# EAGLE design sr_controller_v0 (EAGLE 6.3)
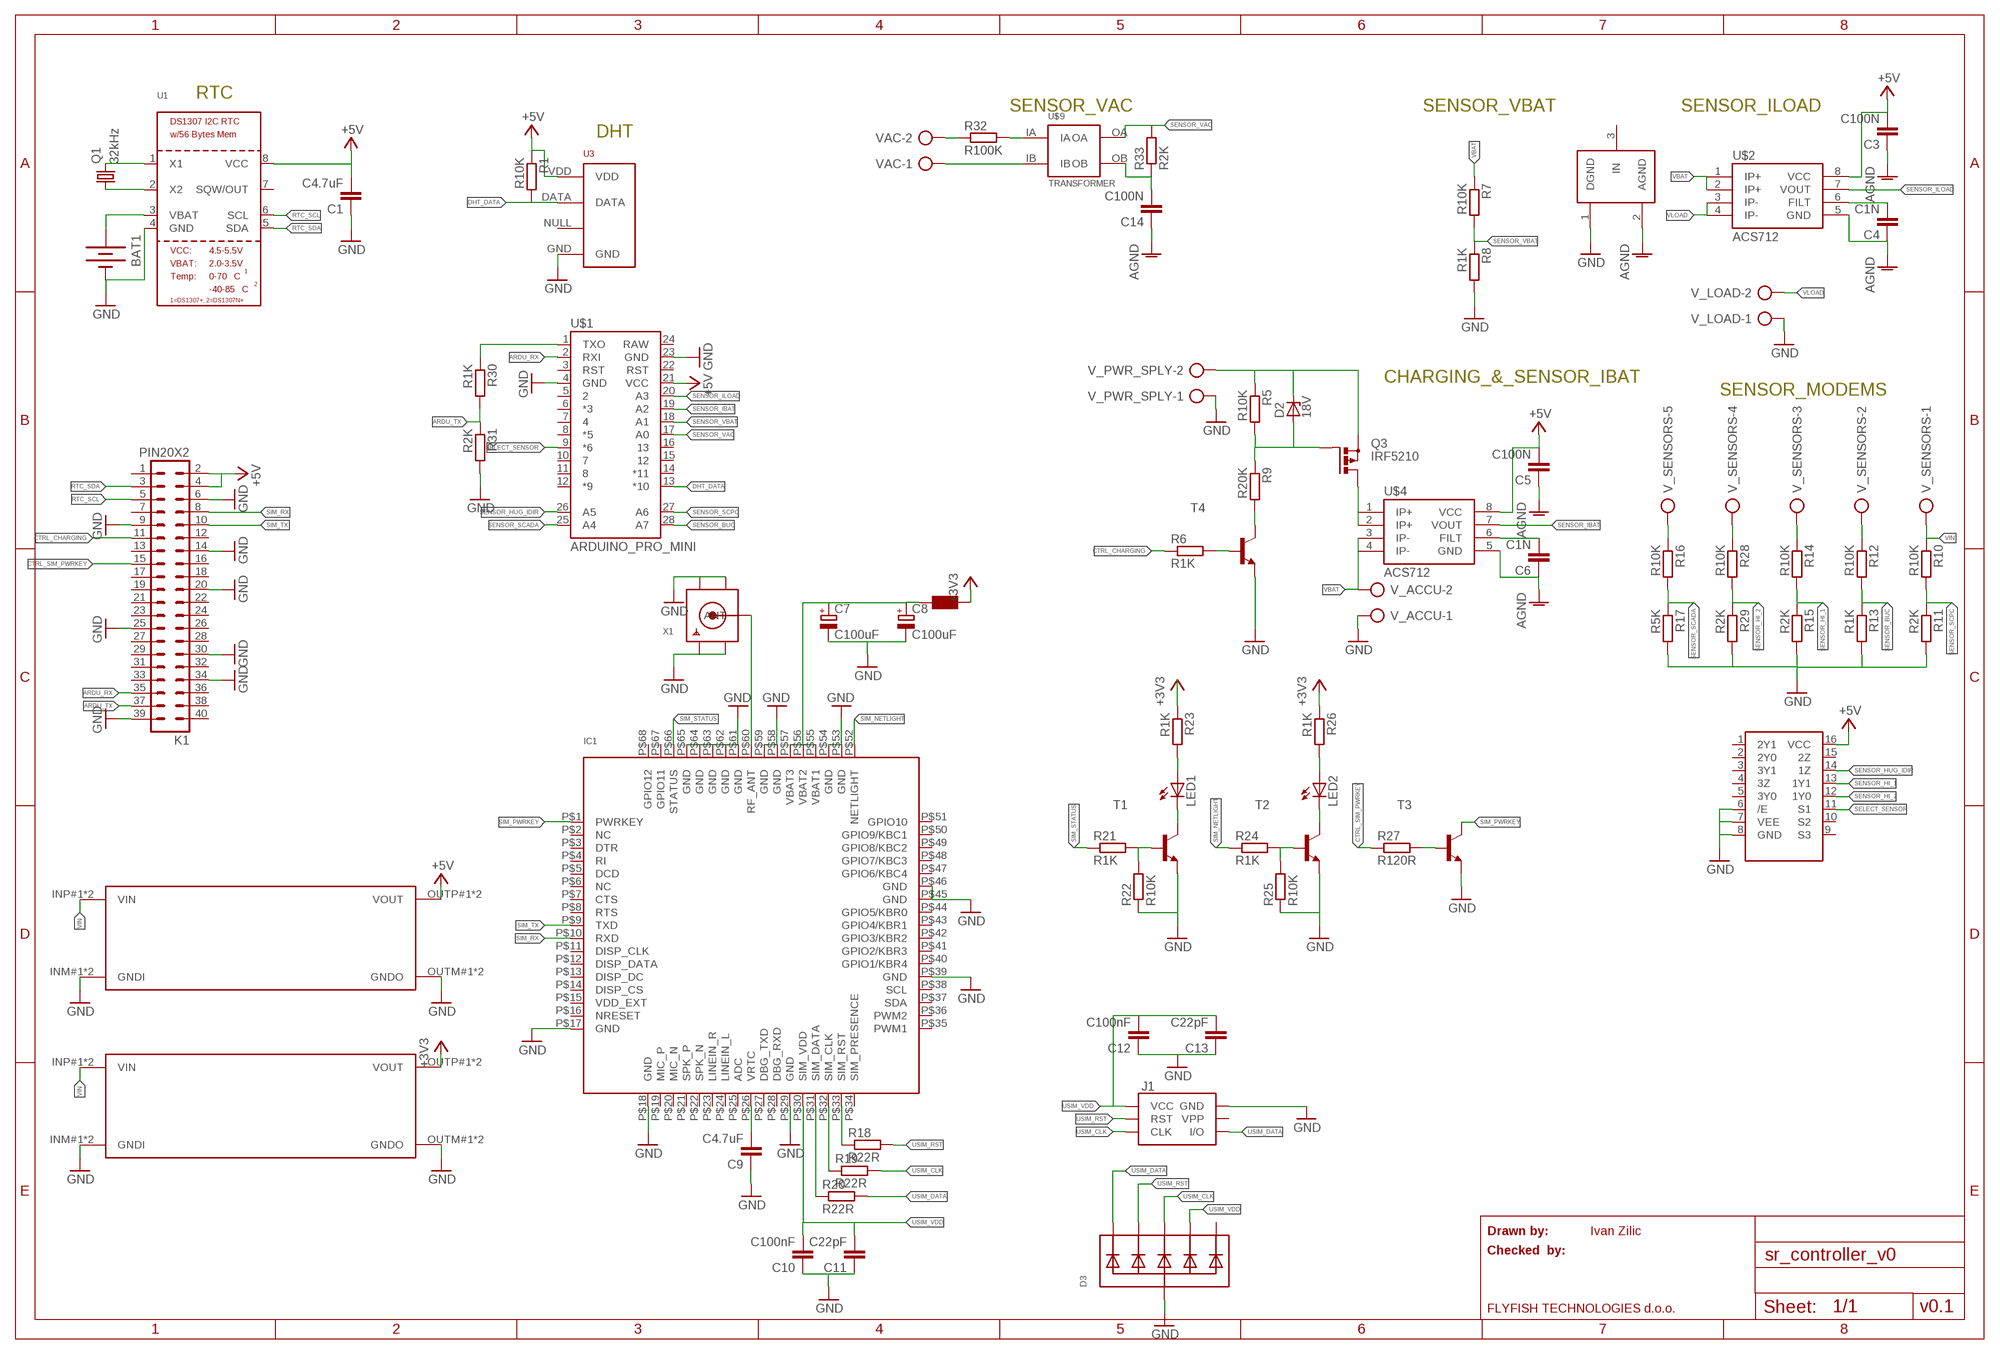
[diagram p0: schematic, sheet 1]

## Parts
BAT1  BATTERY20PTH  [BATTCOM_20MM_PTH]
C1  C4.7uF  C-EUC0805  [C0805]
C3  C100N  C-EUC0805K  [C0805K]
C4  C1N  C-EUC0805K  [C0805K]
C5  C100N  C-EUC0805K  [C0805K]
C6  C1N  C-EUC0805K  [C0805K]
C7  C100uF  CPOL-EU153CLV-0605  [153CLV-0605]
C8  C100uF  CPOL-EU153CLV-0605  [153CLV-0605]
C9  C4.7uF  C-EUC0805  [C0805]
C10  C100nF  C-EUC0805  [C0805]
C11  C22pF  C-EUC0805  [C0805]
C12  C100nF  C-EUC0805  [C0805]
C13  C22pF  C-EUC0805  [C0805]
C14  C100N  C-EUC0805K  [C0805K]
D2  18V  ZENER-DIODEDO41Z10  [DO41Z10]
D3  TVSARRAY_5LANE  [SOT363]
IC1  GSM_SIM900_LITERAL  [SIM900_SMT]
J1  SIMHOLDERSIM  [SIMHOLDER]
K1  PIN20X2  [PIN_20X2]
LED1  LEDCHIPLED_0805  [CHIPLED_0805]
LED2  LEDCHIPLED_0805  [CHIPLED_0805]
Q1  32kHz  CRYSTALTC38H  [TC38H]
Q3  IRF5210  PMOSFET_PTO220BV  [TO220BV]
R1  R10K  R-EU_R0805  [R0805]
R5  R10K  R-EU_R0805  [R0805]
R6  R1K  R-EU_R0805  [R0805]
R7  R10K  R-EU_R0805  [R0805]
R8  R1K  R-EU_R0805  [R0805]
R9  R20K  R-EU_R0805  [R0805]
R10  R10K  R-EU_R0805  [R0805]
R11  R2K  R-EU_R0805  [R0805]
R12  R10K  R-EU_R0805  [R0805]
R13  R1K  R-EU_R0805  [R0805]
R14  R10K  R-EU_R0805  [R0805]
R15  R2K  R-EU_R0805  [R0805]
R16  R10K  R-EU_R0805  [R0805]
R17  R5K  R-EU_R0805  [R0805]
R18  R22R  R-EU_R0805  [R0805]
R19  R22R  R-EU_R0805  [R0805]
R20  R22R  R-EU_R0805  [R0805]
R21  R1K  R-EU_R0805  [R0805]
R22  R10K  R-EU_R0805  [R0805]
R23  R1K  R-EU_R0805  [R0805]
R24  R1K  R-EU_R0805  [R0805]
R25  R10K  R-EU_R0805  [R0805]
R26  R1K  R-EU_R0805  [R0805]
R27  R120R  R-EU_R0805  [R0805]
R28  R10K  R-EU_R0805  [R0805]
R29  R2K  R-EU_R0805  [R0805]
R30  R1K  R-EU_R0805  [R0805]
R31  R2K  R-EU_R0805  [R0805]
R32  R100K  R-EU_0309/V  [0309V]
R33  R2K  R-EU_0309/V  [0309V]
T1  MMBT2222ALT1-NPN-SOT23-BEC  [SOT23-BEC]
T2  MMBT2222ALT1-NPN-SOT23-BEC  [SOT23-BEC]
T3  MMBT2222ALT1-NPN-SOT23-BEC  [SOT23-BEC]
T4  MMBT2222ALT1-NPN-SOT23-BEC  [SOT23-BEC]
U1  RTC_DS1307  [SOIC8_150MIL]
U3  RHT03_DHT-22_AM2302  [RHT03_DHT-22]
U$1  ARDUINO_PRO_MINI  [ARDUINO_PRO_MINI]
U$2  ACS712  [SO08]
U$3  GND_CONNECT  [GND_CONNECT]
U$4  ACS712  [SO08]
U$5  FB0603  L0603  [L0603]
U$6  DCDCMODULE_SMALL  [DCDCMODULE-SMALL]
U$7  DCDCMODULE_SMALL  [DCDCMODULE-SMALL]
U$8  74HC4053D  [SO16]
U$9  TRANSFORMER  [TV16]
V_ACCU  AK300/2  [AK300/2]
V_LOAD  AK300/2  [AK300/2]
V_PWR_SPLY  AK300/2  [AK300/2]
V_SENSORS  AK300/5  [AK300/5]
VAC  AK300/2  [AK300/2]
X1  SMACONNECTOR  [SMA90_DIP]

## Nets
+3V3: R23.1 R26.1 U$5.2 U$7.OUTP#1(VOUT) U$7.OUTP#2(VOUT)
+5V: C1.2 C3.2 C5.2 K1.2 K1.4 R1.1 U1.8(VCC) U3.VDD U$1.21(VCC) U$2.8(VCC) U$4.8(VCC) U$6.OUTP#1(VOUT) U$6.OUTP#2(VOUT) U$8.16(VCC)
AGND: C3.1 C4.1 C5.1 C6.1 C14.1 U$2.5(GND) U$3.2(AGND) U$4.5(GND)
ARDU_RX: K1.35 U$1.2(RXI)
ARDU_TX: K1.37 R30.2 R31.1
CTRL_CHARGING: K1.11 R6.1
CTRL_SIM_PWRKEY: K1.15 R27.1
DHT_DATA: R1.2 U3.DATA U$1.13(*10)
GND: BAT1.2(-) C1.1 C7.- C8.- C9.1 C10.1 C11.1 C12.1 C13.1 D3.2(A) IC1.P$17(GND) IC1.P$18(GND) IC1.P$29(GND) IC1.P$39(GND) IC1.P$45(GND) IC1.P$46(GND) IC1.P$53(GND) IC1.P$54(GND) IC1.P$58(GND) IC1.P$59(GND) IC1.P$61(GND) IC1.P$62(GND) IC1.P$63(GND) IC1.P$64(GND) IC1.P$65(GND) J1.C5(GND) K1.6 K1.9 K1.14 K1.20 K1.25 K1.30 K1.34 K1.39 R8.2 R11.2 R13.2 R15.2 R17.2 R22.1 R25.1 R29.2 R31.2 T1.E T2.E T3.E T4.E U1.4(GND) U3.GND U$1.4(GND) U$1.23(GND) U$3.1(DGND) U$6.INM#1(GNDI) U$6.INM#2(GNDI) U$6.OUTM#1(GNDO) U$6.OUTM#2(GNDO) U$7.INM#1(GNDI) U$7.INM#2(GNDI) U$7.OUTM#1(GNDO) U$7.OUTM#2(GNDO) U$8.6(/E) U$8.7(VEE) U$8.8(GND) V_ACCU.1 V_LOAD.1 V_PWR_SPLY.1 X1.GND1 X1.GND2 X1.GND3 X1.GND4
N$1: R32.1 VAC.2
N$2: U$9.IB VAC.1
N$3: Q1.2 U1.1(X1)
N$4: Q1.1 U1.2(X2)
N$5: BAT1.1(+) U1.3(VBAT)
N$6: R12.1 V_SENSORS.2
N$10: C4.2 U$2.6(FILT)
N$11: D2.A Q3.G R5.2 R9.1
N$12: D2.C Q3.S R5.1 V_PWR_SPLY.2
N$13: R6.2 T4.B
N$14: R9.2 T4.C
N$15: Q3.D U$4.1(IP+) U$4.2(IP+)
N$16: C6.2 U$4.6(FILT)
N$18: R14.1 V_SENSORS.3
N$19: R28.1 V_SENSORS.4
N$20: R16.1 V_SENSORS.5
N$21: IC1.P$60(RF_ANT) X1.ANTENNA(ANT)
N$22: C7.+ C8.+ IC1.P$55(VBAT1) IC1.P$56(VBAT2) IC1.P$57(VBAT3) U$5.1
N$23: C9.2 IC1.P$26(VRTC)
N$24: IC1.P$33(SIM_RST) R18.1
N$25: IC1.P$32(SIM_CLK) R19.1
N$26: IC1.P$31(SIM_DATA) R20.1
N$27: LED1.C T1.C
N$28: LED1.A R23.2
N$29: LED2.C T2.C
N$30: R21.2 R22.2 T1.B
N$31: LED2.A R26.2
N$32: R24.2 R25.2 T2.B
N$33: R27.2 T3.B
N$35: R30.1 U$1.1(TXO)
N$36: R32.2 U$9.IA
N$38: C14.2 R33.1 U$9.OB
RTC_SCL: K1.5 U1.6(SCL)
RTC_SDA: K1.3 U1.5(SDA)
SELECT_SENSOR: U$1.9(*6) U$8.11(S1)
SENSOR_BUC: R12.2 R13.1 U$1.28(A7)
SENSOR_HI_1: R14.2 R15.1 U$8.13(1Y1)
SENSOR_HI_2: R28.2 R29.1 U$8.12(1Y0)
SENSOR_HUG_IDIR: U$1.26(A5) U$8.14(1Z)
SENSOR_IBAT: U$1.19(A2) U$4.7(VOUT)
SENSOR_ILOAD: U$1.20(A3) U$2.7(VOUT)
SENSOR_SCADA: R16.2 R17.1 U$1.25(A4)
SENSOR_SCPC: R10.2 R11.1 U$1.27(A6)
SENSOR_VAC: R33.2 U$1.17(A0) U$9.OA
SENSOR_VBAT: R7.2 R8.1 U$1.18(A1)
SIM_NETLIGHT: IC1.P$52(NETLIGHT) R24.1
SIM_PWRKEY: IC1.P$1(PWRKEY) T3.C
SIM_RX: IC1.P$10(RXD) K1.8
SIM_STATUS: IC1.P$66(STATUS) R21.1
SIM_TX: IC1.P$9(TXD) K1.10
USIM_CLK: D3.4(C3) J1.C3(CLK) R19.2
USIM_DATA: D3.1(C1) J1.C7(I/O) R20.2
USIM_RST: D3.3(C2) J1.C2(RST) R18.2
USIM_VDD: C10.2 C11.2 C12.2 C13.2 D3.5(C4) IC1.P$30(SIM_VDD) J1.C1(VCC)
VBAT: R7.1 U$2.1(IP+) U$2.2(IP+) U$4.3(IP-) U$4.4(IP-) V_ACCU.2
VIN: R10.1 U$6.INP#1(VIN) U$6.INP#2(VIN) U$7.INP#1(VIN) U$7.INP#2(VIN) V_SENSORS.1
VLOAD: U$2.3(IP-) U$2.4(IP-) V_LOAD.2
Unconnected: D3.6(C5) IC1.P$2(NC) IC1.P$3(DTR) IC1.P$4(RI) IC1.P$5(DCD) IC1.P$6(NC) IC1.P$7(CTS) IC1.P$8(RTS) IC1.P$11(DISP_CLK) IC1.P$12(DISP_DATA) IC1.P$13(DISP_DC) IC1.P$14(DISP_CS) IC1.P$15(VDD_EXT) IC1.P$16(NRESET) IC1.P$19(MIC_P) IC1.P$20(MIC_N) IC1.P$21(SPK_P) IC1.P$22(SPK_N) IC1.P$23(LINEIN_R) IC1.P$24(LINEIN_L) IC1.P$25(ADC) IC1.P$27(DBG_TXD) IC1.P$28(DBG_RXD) IC1.P$34(SIM_PRESENCE) IC1.P$35(PWM1) IC1.P$36(PWM2) IC1.P$37(SDA) IC1.P$38(SCL) IC1.P$40(GPIO1/KBR4) IC1.P$41(GPIO2/KBR3) IC1.P$42(GPIO3/KBR2) IC1.P$43(GPIO4/KBR1) IC1.P$44(GPIO5/KBR0) IC1.P$47(GPIO6/KBC4) IC1.P$48(GPIO7/KBC3) IC1.P$49(GPIO8/KBC2) IC1.P$50(GPIO9/KBC1) IC1.P$51(GPIO10) J1.C6(VPP) K1.1 K1.7 K1.12 K1.13 K1.16 K1.17 K1.18 K1.19 K1.21 K1.22 K1.23 K1.24 K1.26 K1.27 K1.28 K1.29 K1.31 K1.32 K1.33 K1.36 K1.38 K1.40 U1.7(SQW/OUT) U3.NULL U$1.3(RST) U$1.5 U$1.6(*3) U$1.7 U$1.8(*5) U$1.10 U$1.11 U$1.12(*9) U$1.14(*11) U$1.15 U$1.16 U$1.22(RST) U$1.24(RAW) U$3.3(IN) U$8.1(2Y1) U$8.2(2Y0) U$8.3(3Y1) U$8.4(3Z) U$8.5(3Y0) U$8.9(S3) U$8.10(S2) U$8.15(2Z)

## Notes on the sheet
- RTC
- SENSOR_VAC | SENSOR_VBAT | SENSOR_ILOAD
- DHT
- CHARGING_&_SENSOR_IBAT
- SENSOR_MODEMS
- Drawn by: | Ivan Zilic
- Checked  by:
- FLYFISH TECHNOLOGIES d.o.o. | v0.1

## Power pins joined to a net without a drawn wire
GPIO11: IC1.P$67(GPIO11)
GPIO12: IC1.P$68(GPIO12)

## Library data of the parts
BAT1 = SparkFun-Electromechanical:BATTERY: Battery Holders Various common sizes : AA, AAA, 20mm coin cell and 12mm coin cell. 20MM_4LEGS, BATT-10373
C1 C3-C6 C9-C14 = resistor:C-EU: CAPACITOR, European symbol
C7 C8 = resistor:CPOL-EU: POLARIZED CAPACITOR, European symbol
D2 = diode:ZENER-DIODE: Z-Diode
D3 = microbuilder:TVSARRAY_5LANE: Voltage Transient Suppressor Array SOT363 SMF05C - 100W 5V: Digikey - SMF05CT1GOSCT-ND
IC1 = microbuilder:GSM_SIM900_LITERAL: SIM900 Quad-Band GSM/GPRS Module Power Supply: 3.2-4.8V Temperature Range: -30�C-+80�C Bands: GSM 850, EGSM 900, DCS 1800, PCS 1900
J1 = SparkFun-Connectors:SIMHOLDER: SIM Socket Socket for SIM cellular cards. Schematic element and footprint production proven. Spark Fun Electronics SKU : PRT-00548; PROD_ID: CONN-08536
K1 = FLYFISH:PIN20X2
LED1 LED2 = adafruit:LED: LED OSRAM: - CHIPLED LG R971, LG N971, LY N971, LG Q971, LY Q971, LO R971, LY R971 LH N974, LH R974 LS Q976, LO Q976, LY Q976 LO Q996 - Hyper CHIPLED LW Q18S LB Q993, LB Q99A, LB R99A - SideLED LS A670, LO A670, LY A670, LG A670, LP A670 LB A673, LV A673, LT A673, LW A673 LH A674 LY A675 LS A676, LA A676, LO A676, LY A676, LW A676 LS A679, LY A679, LG A679 - Hyper Micro SIDELED® LS Y876, LA Y876, LO Y876, LY Y876 LT Y87S - SmartLED LW L88C, LW L88S LB L89C, LB L89S, LG L890 LS L89K, LO L89K, LY L89K LS L896, LA L896, LO L896, LY L896 - TOPLED LS T670, LO T670, LY T670, LG T670, LP T670 LSG T670, LSP T670, LSY T670, LOP T670, LYG T670 LG T671, LOG T671, LSG T671 LB T673, LV T673, LT T673, LW T673 LH T674 LS T676, LA T676, LO T676, LY T676, LB T676, LH T676, LSB T676, LW T676 LB T67C, LV T67C, LT T67C, LS T67K, LO T67K, LY T67K, LW E67C LS E67B, LA E67B, LO E67B, LY E67B, LB E67C, LV E67C, LT E67C LW T67C LS T679, LY T679, LG T679 LS T770, LO T770, LY T770, LG T770, LP T770 LB T773, LV T773, LT T773, LW T773 LH T774 LS E675, LA E675, LY E675, LS T675 LS T776, LA T776, LO T776, LY T776, LB T776 LHGB T686 LT T68C, LB T68C - Hyper Mini TOPLED® LB M676 - Mini TOPLED Santana® LG M470 LS M47K, LO M47K, LY M47K Source: http://www.osram.convergy.de/
Q1 = crystal:CRYSTAL: CRYSTAL; OC_FARNELL: unknown; OC_NEWARK: unknown
Q3 = transistor-power:PMOSFET_P: Power MOSFET P-Channel
R1 R5-R33 = resistor:R-EU_: RESISTOR, European symbol
T1-T4 = transistor:*-NPN-: NPN Transistror BF959 corrected 2008.03.06
U1 = microbuilder:RTC_DS1307: DS1307 I2C RTC with 56-Bytes RAM
U3 = RHT03_DHT-22_AM2302:RHT03_DHT-22_AM2302: RHT03 / DHT-22 / AM2302 Packages and symbol for the RHT03 / DHT-22 relative humidity and temperature sensor. Note: The AM2302 is a wired version of the DHT-22 which typically requires less clearance and is thus provided as a separate package.; PROD_ID: SEN-10167
U$1 = tigorcustom:ARDUINO_PRO_MINI
U$2 U$4 = SparkFun-AnalogIC:ACS712: Hall-effect-based isolated linear current sensor
U$3 = SparkFun-Passives:GND_CONNECT: Use to make a connection of multiple grounds in only one place.
U$5 = tigorcustom:L0603
U$6 U$7 = bontor:DCDCMODULE_SMALL
U$8 = tigorcustom:74HC4053D
U$9 = bontor:TRANSFORMER
V_ACCU V_LOAD V_PWR_SPLY VAC = con-ptr500:AK300/2: CONNECTOR; OC_FARNELL: unknown; OC_NEWARK: unknown
V_SENSORS = con-ptr500:AK300/5: CONNECTOR; OC_FARNELL: unknown; OC_NEWARK: unknown
X1 = microbuilder:SMACONNECTOR: SMA Connector 90� DIP SMA Connector, 50 Ohm (4UConnector: 07259)

## Board
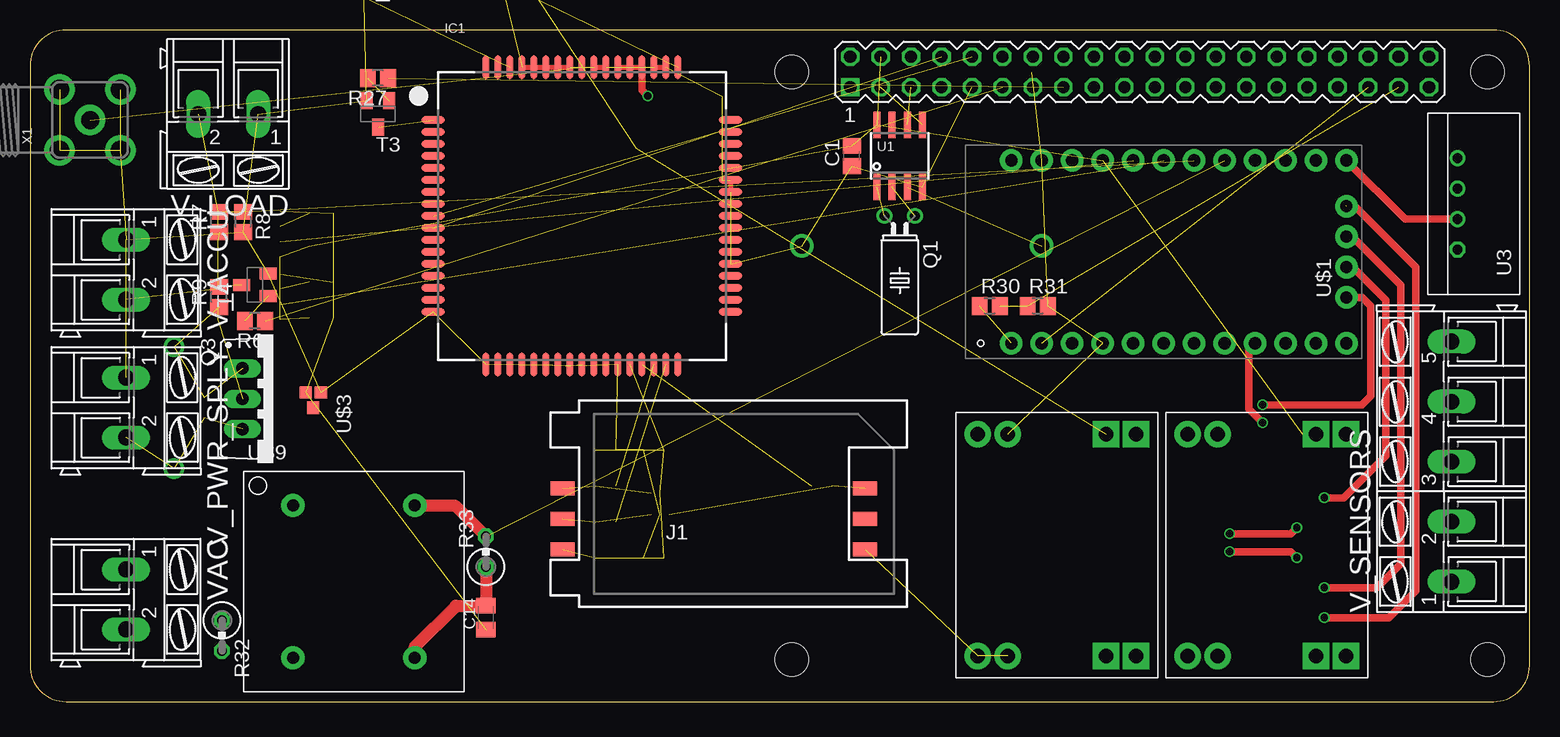
[diagram p1: board, top side]
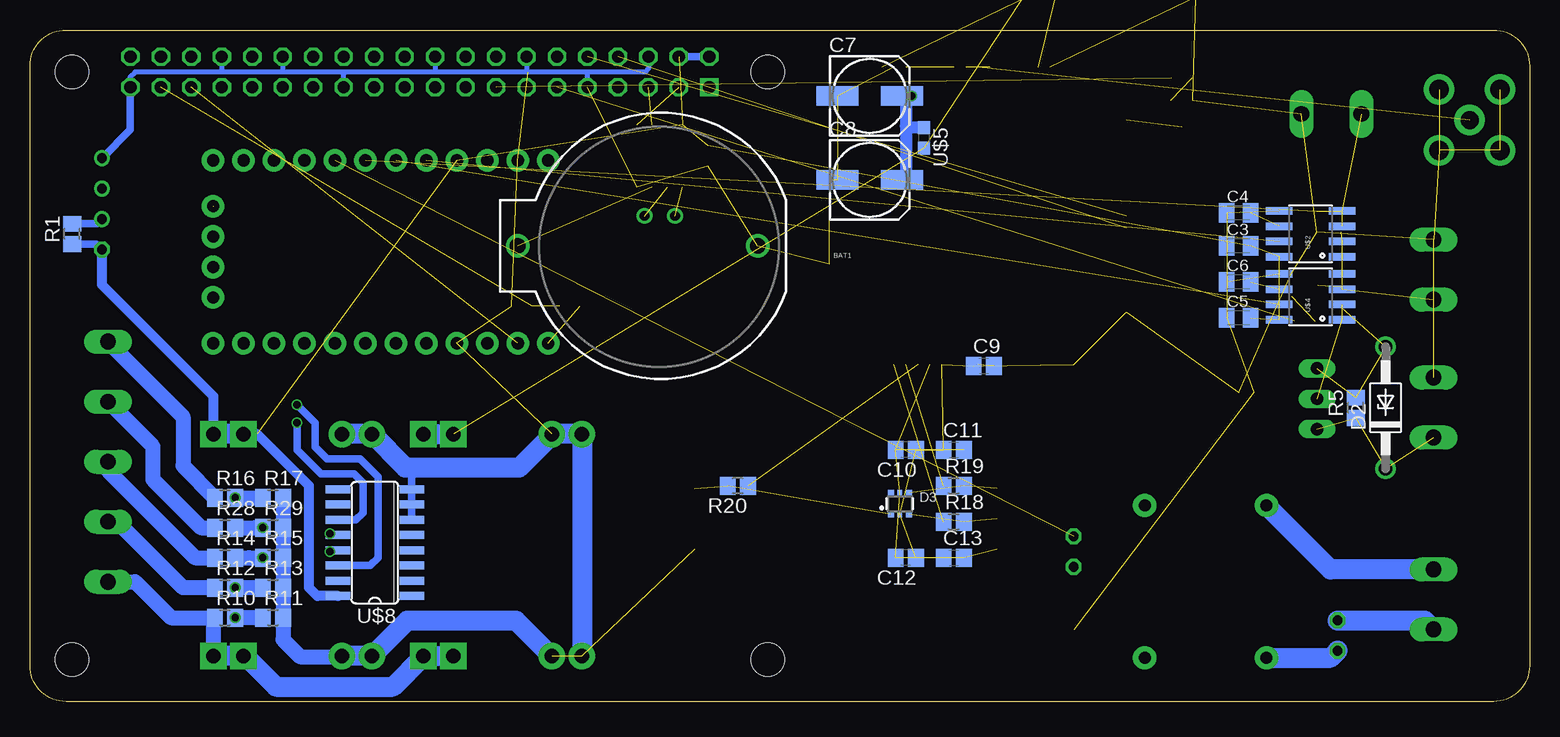
[diagram p2: board, bottom side, seen from below]

Size 125 x 56 mm. Coordinates in mm from the lower left corner, seen from the top.
Outline: 0,3 arc90 3,0 122,0 arc90 125,3 125,53 arc90 122,56 3,56 arc90 0,53 0,3
Copper layers (1*16): Top 0.035mm / dielectric 1.5mm / Bottom 0.035mm
Design rules "ITEADstudio_DRC": minimum track width 6mil, minimum drill 12mil, track to track 6mil, track to pad 6mil, pad to pad 6mil, via to via 6mil, smd to smd 0mil, copper to edge 10mil, drill to drill 10mil, minimum pad ring 10mil, minimum via ring 6mil, stop-mask expansion 2mil, vias tented up to drill 100mil, thermal gap 10mil
Holes 2.8 mm at 63.5,3.5 63.5,52.5 121.5,52.5 121.5,3.5
tRestrict: area 62,51 to 65,54; area 120,51 to 123,54; area 120,1.9 to 123,5; area 62,1.9 to 65,5
bRestrict: area 62,1.9 to 65,5; area 62,51 to 65,54; area 120,1.9 to 123,5; area 120,51 to 123,54

### Footprints (pad centres in the part's own frame; a part is rotated, then mirrored left to right if it is on the bottom)
BATTCOM_20MM_PTH = drill 1.3: 1 11.85,0; 2 -8.15,0
C0805 = smd 1.3 x 1.5: 1 -0.85,0; 2 0.85,0
C0805K = smd 1.3 x 1.6: 1 -1,0; 2 1,0
153CLV-0605 = smd 3.5 x 1.6: + 2.7,0; - -2.7,0
DO41Z10 = drill 1.118: A 5.08,0; C -5.08,0
SOT363 = smd 0.5 x 0.5: 1 -0.75,-0.9; 3 0.75,-0.9; 4 0.75,0.9; 6 -0.75,0.9 | smd 0.4 x 0.5: 2 0,-0.9; 5 0,0.9
SIM900_SMT = smd 2 x 0.6: P$1 -12.4,8; P$2 -12.4,7; P$3 -12.4,6; P$4 -12.4,5; P$5 -12.4,4; P$6 -12.4,3; P$7 -12.4,2; P$8 -12.4,1; P$9 -12.4,0; P$10 -12.4,-1; P$11 -12.4,-2; P$12 -12.4,-3; P$13 -12.4,-4; P$14 -12.4,-5; P$15 -12.4,-6; P$16 -12.4,-7; P$17 -12.4,-8; P$35 12.4,-8; P$36 12.4,-7; P$37 12.4,-6; P$38 12.4,-5; P$39 12.4,-4; P$40 12.4,-3; P$41 12.4,-2; P$42 12.4,-1; P$43 12.4,0; P$44 12.4,1; P$45 12.4,2; P$46 12.4,3; P$47 12.4,4; P$48 12.4,5; P$49 12.4,6; P$50 12.4,7; P$51 12.4,8 | smd 0.6 x 2: P$18 -8,-12.4; P$19 -7,-12.4; P$20 -6,-12.4; P$21 -5,-12.4; P$22 -4,-12.4; P$23 -3,-12.4; P$24 -2,-12.4; P$25 -1,-12.4; P$26 0,-12.4; P$27 1,-12.4; P$28 2,-12.4; P$29 3,-12.4; P$30 4,-12.4; P$31 5,-12.4; P$32 6,-12.4; P$33 7,-12.4; P$34 8,-12.4; P$52 8,12.4; P$53 7,12.4; P$54 6,12.4; P$55 5,12.4; P$56 4,12.4; P$57 3,12.4; P$58 2,12.4; P$59 1,12.4; P$60 0,12.4; P$61 -1,12.4; P$62 -2,12.4; P$63 -3,12.4; P$64 -4,12.4; P$65 -5,12.4; P$66 -6,12.4; P$67 -7,12.4; P$68 -8,12.4
SIMHOLDER = smd 2 x 1.2: C1 -12.61,-3.81; C2 -12.61,-1.27; C3 -12.61,1.27; C5 12.61,-3.81; C6 12.61,-1.27; C7 12.61,1.27
PIN_20X2 = drill 1.016 square: 1 -24.13,-1.27 | drill 1.016 octagon: 2 -24.13,1.27; 3 -21.59,-1.27; 4 -21.59,1.27; 5 -19.05,-1.27; 6 -19.05,1.27; 7 -16.51,-1.27; 8 -16.51,1.27; 9 -13.97,-1.27; 10 -13.97,1.27; 11 -11.43,-1.27; 12 -11.43,1.27; 13 -8.89,-1.27; 14 -8.89,1.27; 15 -6.35,-1.27; 16 -6.35,1.27; 17 -3.81,-1.27; 18 -3.81,1.27; 19 -1.27,-1.27; 20 -1.27,1.27; 21 1.27,-1.27; 22 1.27,1.27; 23 3.81,-1.27; 24 3.81,1.27; 25 6.35,-1.27; 26 6.35,1.27; 27 8.89,-1.27; 28 8.89,1.27; 29 11.43,-1.27; 30 11.43,1.27; 31 13.97,-1.27; 32 13.97,1.27; 33 16.51,-1.27; 34 16.51,1.27; 35 19.05,-1.27; 36 19.05,1.27; 37 21.59,-1.27; 38 21.59,1.27; 39 24.13,-1.27; 40 24.13,1.27
CHIPLED_0805 = smd 1.2 x 1.2: A 0,-1.05; C 0,1.05
TC38H = drill 0.813: 1 -1.27,0; 2 1.27,0
TO220BV = drill 1.016 long: D 0,-2.54; G -2.54,-2.54; S 2.54,-2.54
R0805 = smd 1.3 x 1.5: 1 -0.85,0; 2 0.85,0
0309V = drill 0.813 octagon: 1 -1.27,0; 2 1.27,0
SOT23-BEC = smd 1 x 1.4: B -0.95,-1.1; C 0,1.1; E 0.95,-1.1
SOIC8_150MIL = smd 0.6 x 2.2: 1 -1.905,-2.6; 2 -0.635,-2.6; 3 0.635,-2.6; 4 1.905,-2.6; 5 1.905,2.6; 6 0.635,2.6; 7 -0.635,2.6; 8 -1.905,2.6
RHT03_DHT-22 = drill 0.8: DATA -1.27,0; GND 3.81,0; NULL 1.27,0 | drill 0.8 octagon: VDD -3.81,0
ARDUINO_PRO_MINI = drill 1.016 pad 1.88: 1 -7.62,12.7; 2 -7.62,10.16; 3 -7.62,7.62; 4 -7.62,5.08; 5 -7.62,2.54; 6 -7.62,0; 7 -7.62,-2.54; 8 -7.62,-5.08; 9 -7.62,-7.62; 10 -7.62,-10.16; 11 -7.62,-12.7; 12 -7.62,-15.24; 13 7.62,-15.24; 14 7.62,-12.7; 15 7.62,-10.16; 16 7.62,-7.62; 17 7.62,-5.08; 18 7.62,-2.54; 19 7.62,0; 20 7.62,2.54; 21 7.62,5.08; 22 7.62,7.62; 23 7.62,10.16; 24 7.62,12.7; 25 -1.27,-15.24; 26 -3.81,-15.24; 27 3.81,-15.24; 28 1.27,-15.24
SO08 = smd 0.61 x 2.21: 1 -1.905,-2.616; 2 -0.635,-2.616; 3 0.635,-2.616; 4 1.905,-2.616; 5 1.905,2.616; 6 0.635,2.616; 7 -0.635,2.616; 8 -1.905,2.616
GND_CONNECT = smd 1.016 x 1.016: 1 -1.016,0; 2 -1.016,-1.27; 3 0.254,-0.635
L0603 = smd 1.1 x 1: 1 -0.85,0; 2 0.85,0
DCDCMODULE-SMALL = drill 1.2 pad 2.184: INM#1 1.8,15; INM#2 1.8,12.5; OUTM#1 20.3,15; OUTM#2 20.3,12.5 | drill 1.2 pad 2.184 square: INP#1 1.8,4.3; INP#2 1.8,1.8; OUTP#1 20.3,4.3; OUTP#2 20.3,1.8
SO16 = smd 0.66 x 2.032: 1 -4.445,-3.073; 2 -3.175,-3.073; 3 -1.905,-3.073; 4 -0.635,-3.073; 5 0.635,-3.073; 6 1.905,-3.073; 7 3.175,-3.073; 8 4.445,-3.073; 9 4.445,3.073; 10 3.175,3.073; 11 1.905,3.073; 12 0.635,3.073; 13 -0.635,3.073; 14 -1.905,3.073; 15 -3.175,3.073; 16 -4.445,3.073
TV16 = drill 1 pad 1.93: IA -5.08,-6.35; IB -5.08,6.35; OA 5.08,6.35; OB 5.08,-6.35
AK300/2 = drill 1.321 long: 1 -2.515,0; 2 2.489,0
AK300/5 = drill 1.321 long: 1 -10.008,0; 2 -5.004,0; 3 0,0; 4 5.004,0; 5 10.008,0
SMA90_DIP = drill 1.5 pad 2.54: ANTENNA 0,0 | drill 1.6 pad 2.54: GND1 -2.54,2.54; GND2 2.54,2.54; GND3 -2.54,-2.54; GND4 2.54,-2.54

### Placement (x,y rotation side)
BAT1  72.5,38 180 bottom
C1  68.5,45.5 90 top
C3  24.25,38 0 bottom
C4  24.25,40.75 0 bottom
C5  24.25,32 0 bottom
C6  24.25,35 0 bottom
C7  55,50.5 0 bottom
C8  55,43.5 0 bottom
C9  45.5,28 0 bottom
C10  52,21 180 bottom
C11  48,21 0 bottom
C12  52,12 180 bottom
C13  48,12 0 bottom
C14  38,7 90 top
D2  12,24.5 90 bottom
D3  52.5,16.5 0 bottom
IC1  46,40.5 0 top
J1  57,16.5 0 top
K1  92.5,52.5 0 top
LED1  23,64.75 0 top  (outside the outline)
LED2  40.5,66.25 0 top  (outside the outline)
Q1  72.5,40.5 180 top
Q3  20.25,25.25 270 top
R1  121.5,39 90 bottom
R5  14.5,24.5 90 bottom
R6  18.75,31.75 180 top
R7  15.75,40 90 top
R8  17.75,40 270 top
R9  15.75,33.75 90 top
R10  108.75,7 0 bottom
R11  104.75,7 0 bottom
R12  108.75,9.5 0 bottom
R13  104.75,9.5 0 bottom
R14  108.75,12 0 bottom
R15  104.75,12 0 bottom
R16  108.75,17 0 bottom
R17  104.75,17 0 bottom
R18  48,15 0 bottom
R19  48,18 0 bottom
R20  66,18 180 bottom
R21  25.5,60.75 90 top  (outside the outline)
R22  27.75,60.75 270 top  (outside the outline)
R23  23.25,60.75 90 top  (outside the outline)
R24  36.5,62.25 90 top  (outside the outline)
R25  38.5,62.25 270 top  (outside the outline)
R26  40.5,62.25 90 top  (outside the outline)
R27  29,52 180 top
R28  108.75,14.5 0 bottom
R29  104.75,14.5 0 bottom
R30  80,33 0 top
R31  84,33 0 top
R32  16,5.5 270 top
R33  38,12.5 90 top
T1  25.5,65 0 top  (outside the outline)
T2  38,66.5 0 top  (outside the outline)
T3  29,49 180 top
T4  18.75,34.75 90 top
U1  72.5,45.5 0 top
U3  119,41.5 90 top
U$1  94.5,37.5 90 top
U$2  18.25,39 90 bottom
U$3  24.25,24.75 270 top
U$4  18.25,33.75 90 bottom
U$5  50.5,47 270 bottom
U$6  111.5,2 90 top
U$7  94,2 90 top
U$8  96.25,13.25 90 bottom
U$9  27,10 0 top
V_ACCU  8,36 270 top
V_LOAD  16.5,49 180 top
V_PWR_SPLY  8,24.5 270 top
V_SENSORS  118.5,20 90 top
VAC  8,8.5 270 top
X1  5,48.5 90 top

### Tracks (layer width: path | path; a pad name or v marks a point on that pad's centre or on a via)
+3V3  (3 unrouted)
  Bottom 1.676: U$7.OUTP#2 U$7.OUTP#1
+5V  (8 unrouted)
  Bottom 0.61: R1.1 119.46,38.15 U3.VDD | K1.2 K1.4
  Bottom 0.813: U$8.16 101.06,8.8 101.75,9.5 101.75,18 106.05,22.3 U$6.OUTP#1 | U$6.OUTP#2 109.7,25.45 119,34.75 U3.VDD
  Bottom 1.676: U$6.OUTP#1 U$6.OUTP#2
AGND  (7 unrouted)
ARDU_RX  (1 unrouted)
ARDU_TX  (2 unrouted)
CTRL_CHARGING  (1 unrouted)
CTRL_SIM_PWRKEY  (1 unrouted)
DHT_DATA
  Top 0.61: U3.DATA 114.63,40.23 U$1.13
  Bottom 0.61: R1.2 119.38,39.85 U3.DATA
GND  (40 unrouted)
  Top 0.406: IC1.P$65 IC1.P$64 IC1.P$63 IC1.P$62 IC1.P$61 | IC1.P$59 IC1.P$58 | IC1.P$54 IC1.P$53 | IC1.P$46 IC1.P$45
  Bottom 0.406: K1.6 73.45,52.8 73.75,52.5 78.5,52.5 | K1.9 78.53,52.47 78.5,52.5 | 78.5,52.5 83.5,52.5 | 83.5,52.5 91.25,52.5 | 91.25,52.5 99,52.5 | 99,52.5 104,52.5 | 104,52.5 109,52.5 | 109,52.5 116.25,52.5 116.63,52.12 K1.39 | K1.14 83.61,52.61 83.5,52.5 | K1.20 91.23,52.52 91.25,52.5 | K1.25 98.85,52.35 99,52.5 | K1.30 103.93,52.57 104,52.5 | K1.34 109.01,52.51 109,52.5
  Bottom 0.61: U$8.6 U$8.7 U$8.8 93.18,19.43 93.25,19.5 | 91.68,19.43 91.75,19.5 | K1.39 116.63,47.68 U3.GND
  Bottom 1.27: R17.2 R29.2 R15.2 R13.2 R11.2 103.9,5.15 102.5,3.75 99.05,3.75 U$6.INM#2
  Bottom 1.676: U$6.INM#2 U$6.INM#1 93.55,6.75 84.5,6.75 81.55,3.8 U$7.INM#2 | U$7.INM#1 U$7.OUTM#1 U$7.OUTM#2 81.5,22.25 84.25,19.5 91.75,19.5 93.25,19.5 93.7,19.5 U$6.OUTM#1 U$6.OUTM#2
N$1
  Bottom 1.676: R32.1 8.76,6.77 VAC.2
N$2
  Bottom 1.676: VAC.1 16.59,11.02 U$9.IB
N$3  (1 unrouted)
N$4  (1 unrouted)
N$5  (1 unrouted)
N$6
  Bottom 1.27: R12.1 112.25,9.5 117.75,15 V_SENSORS.2
N$10  (1 unrouted)
N$11  (3 unrouted)
N$12  (3 unrouted)
N$13  (1 unrouted)
N$14  (1 unrouted)
N$15  (2 unrouted)
N$16  (1 unrouted)
N$18
  Bottom 1.27: V_SENSORS.3 118.5,19.25 111.25,12 R14.1
N$19
  Bottom 1.27: R28.1 110.75,14.5 114.75,18.5 114.75,21.25 V_SENSORS.4
N$20
  Bottom 1.27: V_SENSORS.5 112.25,23.75 112.25,19.65 R16.1
N$21  (1 unrouted)
N$22  (via drill 0.6)
  Top 0.406: IC1.P$57 IC1.P$56 IC1.P$55
  Top 0.61: IC1.P$55 51,51 v51.5,50.5
  Bottom 1.016: v51.5,50.5 52,50 | 52,50 52,48 | 52,48 52,43.8 C8.+ | U$5.1 51.85,47.85 52,48 | 52,50 52,50.2 C7.+
N$23  (1 unrouted)
N$24  (1 unrouted)
N$25  (1 unrouted)
N$26  (1 unrouted)
N$27  (1 unrouted)
N$28  (1 unrouted)
N$29  (1 unrouted)
N$30  (2 unrouted)
N$31  (1 unrouted)
N$32  (2 unrouted)
N$33  (1 unrouted)
N$35  (1 unrouted)
N$36
  Bottom 1.676: U$9.IA 16.58,3.65 R32.2
N$38
  Top 1.016: R33.1 C14.2 35.5,8 32.08,4.58 U$9.OB
RTC_SCL  (1 unrouted)
RTC_SDA  (1 unrouted)
SELECT_SENSOR  (via drill 0.6)
  Top 0.61: v102.75,23.25 101.62,24.38 101.62,29.38 U$1.9
  Bottom 0.61: U$8.11 97.84,15.15 97.25,15.75 97.25,18.25 98,19 100.75,19 102.75,21 v102.75,23.25
SENSOR_BUC  (via drill 0.6)
  Top 0.61: R12.2 112.25,9.5 114.25,11.5 114.25,34.75 110.25,38.75 109.76,38.75 U$1.28
  Bottom 1.27: R13.1 R12.2
  other vias: 107.9,9.5
SENSOR_HI_1  (via drill 0.6)
  Top 0.61: v100,12.5 105.1,12.5 R15.1
  Bottom 0.61: U$8.13 100,12.62 v100,12.5
  Bottom 1.27: R14.2 106.75,12 R15.1
  other vias: 105.6,12
SENSOR_HI_2  (via drill 0.6)
  Top 0.61: v100,14 105.1,14 R29.1
  Bottom 0.61: U$8.12 100,13.88 v100,14
  Bottom 1.27: R28.2 106.25,14.5 R29.1
  other vias: 105.6,14.5
SENSOR_HUG_IDIR  (via drill 0.6)
  Top 0.61: v102.75,24.75 111,24.75 111.75,25.5 111.75,33 111.06,33.69 U$1.26
  Bottom 0.61: U$8.14 96.66,11.35 96,12 96,18.75 97.5,20.25 100.25,20.25 101.25,21.25 101.25,23.25 v102.75,24.75
SENSOR_IBAT  (1 unrouted)
SENSOR_ILOAD  (1 unrouted)
SENSOR_SCADA  (via drill 0.6)
  Top 0.61: R16.2 109.5,17 113,20.5 113,33.5 110.25,36.25 109.76,36.25 U$1.25
  Bottom 1.27: R16.2 R17.1
  other vias: 107.9,17
SENSOR_SCPC  (via drill 0.6)  (1 unrouted)
  Top 0.61: R10.2 113.25,7 115.5,9.25 115.5,36.25 110.5,41.25 109.8,41.25 U$1.27
  Bottom 1.27: R11.1 R10.2
  other vias: 107.9,7
SENSOR_VAC  (1 unrouted)
  Top 1.016: U$9.OA 35.42,16.35 R33.2
SENSOR_VBAT  (2 unrouted)
SIM_NETLIGHT  (1 unrouted)
SIM_PWRKEY  (1 unrouted)
SIM_RX  (1 unrouted)
SIM_STATUS  (1 unrouted)
SIM_TX  (1 unrouted)
USIM_CLK  (2 unrouted)
USIM_DATA  (2 unrouted)
USIM_RST  (2 unrouted)
USIM_VDD  (6 unrouted)
VBAT  (5 unrouted)
VIN
  Bottom 1.27: V_SENSORS.1 116.24,9.99 113.25,7 R10.1 109.7,6.9 U$6.INP#2
  Bottom 1.676: U$7.INP#1 U$7.INP#2 94.75,1.25 104.5,1.25 107.05,3.8 U$6.INP#1 U$6.INP#2
VLOAD  (2 unrouted)